# Altium schematic sheet P05_BCS1_Ethernet.SchDoc
size A3; Date: 24.11.2011; CheckedBy: Finke; Author: Mierau; DrawnBy: Mierau; SheetNumber: 5; SheetTotal: 8; Anlage: 78; Beschreibung: Qseven; Kunde: 56; ProjektName: BCS1; ProjektNummer: 88xxx; Ersatz_fuer: 12; ersetzt_durch: 34; LKNummer: 6190202; ID_Nummer: 90
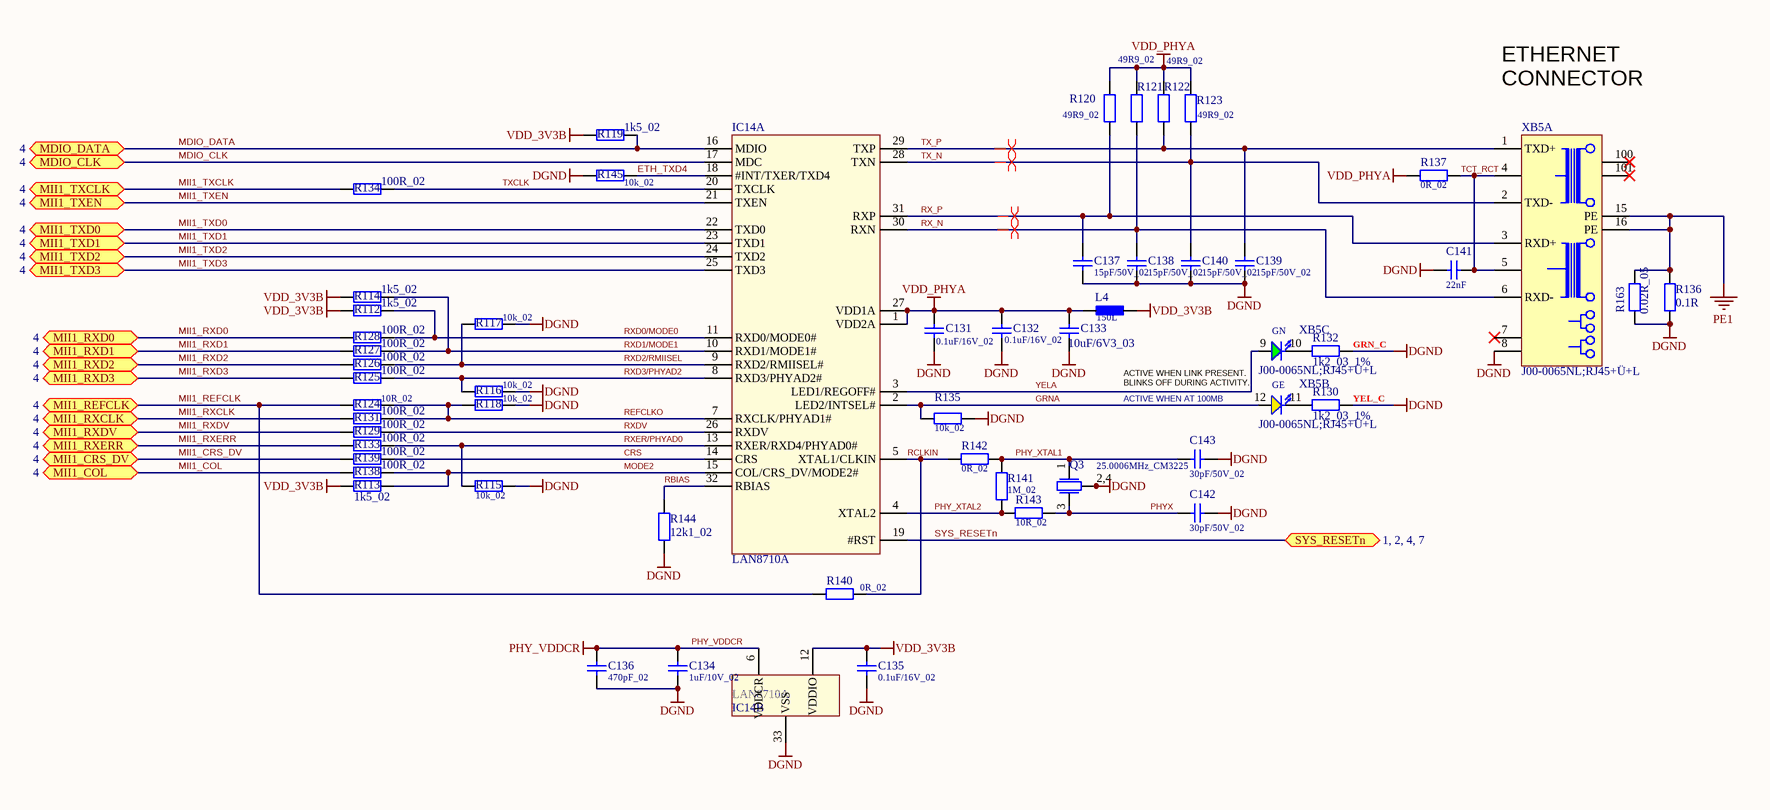
[diagram p0: P05_BCS1_Ethernet.SchDoc]

## Parts
C131  0.1uF/16V_02  [CC1005-0402]
C132  0.1uF/16V_02  [CC1005-0402]
C133  10uF/6V3_03  [CC1608-0603]
C134  1uF/10V_02  [CC1005-0402]
C135  0.1uF/16V_02  [CC1005-0402]
C136  470pF_02  [CC1005-0402]
C137  15pF/50V_02  [CC1005-0402]
C138  15pF/50V_02  [CC1005-0402]
C139  15pF/50V_02  [CC1005-0402]
C140  15pF/50V_02  [CC1005-0402]
C141  22nF  [CC2012-0805]
C142  30pF/50V_02  [CC1005-0402]
C143  30pF/50V_02  [CC1005-0402]
IC14  LAN8710A  [QFN32+EP]  (parts A,B of 2)
L4  150L  [CR2012-0805]
Q3  25.0006MHz_CM3225  [QUARZ CM3225]
R112  1k5_02  [CR1005-0402]
R113  1k5_02  [CR1005-0402]
R114  1k5_02  [CR1005-0402]
R115  10k_02  [CR1005-0402]
R116  10k_02  [CR1005-0402]
R117  10k_02  [CR1005-0402]
R118  10k_02  [CR1005-0402]
R119  1k5_02  [CR1005-0402]
R120  49R9_02  [CR1005-0402]
R121  49R9_02  [CR1005-0402]
R122  49R9_02  [CR1005-0402]
R123  49R9_02  [CR1005-0402]
R124  10R_02  [CR1005-0402]
R125  100R_02  [CR1005-0402]
R126  100R_02  [CR1005-0402]
R127  100R_02  [CR1005-0402]
R128  100R_02  [CR1005-0402]
R129  100R_02  [CR1005-0402]
R130  1k2_03_1%  [CR1608-0603]
R131  100R_02  [CR1005-0402]
R132  1k2_03_1%  [CR1608-0603]
R133  100R_02  [CR1005-0402]
R134  100R_02  [CR1005-0402]
R135  10k_02  [CR1005-0402]
R136  0.1R  [CR3216-1206]
R137  0R_02  [CR1005-0402]
R138  100R_02  [CR1005-0402]
R139  100R_02  [CR1005-0402]
R140  0R_02  [CR1005-0402]
R141  1M_02  [CR1005-0402]
R142  0R_02  [CR1005-0402]
R143  10R_02  [CR1005-0402]
R144  12k1_02  [CR1005-0402]
R145  10k_02  [CR1005-0402]
R163  0.02R_05  [CR2012-0805]
XB5  J00-0065NL;RJ45+Ü+L  [RJ45+Ü+L]  (parts A,B,C of 3)

## Ports
MDIO_CLK (see 4), MDIO_DATA (see 4), MII1_COL (see 4), MII1_CRS_DV (see 4), MII1_REFCLK (see 4), MII1_RXCLK (see 4), MII1_RXD0 (see 4), MII1_RXD1 (see 4), MII1_RXD2 (see 4), MII1_RXD3 (see 4), MII1_RXDV (see 4), MII1_RXERR (see 4), MII1_TXCLK (see 4), MII1_TXD0 (see 4), MII1_TXD1 (see 4), MII1_TXD2 (see 4), MII1_TXD3 (see 4), MII1_TXEN (see 4), SYS_RESETn (see 1, 2, 4, 7)

## Nets
DGND: C131.1 C132.1 C133.1 C134.1 C135.2 C136.1 C137.1 C138.1 C139.1 C140.1 C141.1 C142.2 C143.2 IC14.33(VSS) Q3.2(GND) Q3.4(GND) R115.2 R116.2 R117.2 R118.2 R130.2 R132.2 R135.2 R136.1 R144.2 R145.1 R163.1 XB5.8(NC)
PE1: R136.2 R163.2 XB5.15(PE) XB5.16(PE)
PHY_VDDCR: C134.2 C136.2 IC14.6(VDDCR)
VDD_3V3B: C135.1 IC14.12(VDDIO) L4.2 R112.2 R113.1 R114.2 R119.2
VDD_PHYA: C131.2 C132.2 C133.2 IC14.1(VDD2A) IC14.27(VDD1A) L4.1 R120.1 R121.1 R122.1 R123.1 R137.2
CRS: IC14.14(CRS) R139.2
ETH_TXD4: IC14.18(#INT/TXER/TXD4) R145.2
GRNA: IC14.2(LED2/INTSEL#) R135.1 XB5.12(A)
MDIO_CLK: IC14.17(MDC) ; port MDIO_CLK
MDIO_DATA: IC14.16(MDIO) R119.1 ; port MDIO_DATA
MII1_COL: R138.1 ; port MII1_COL
MII1_CRS_DV: R139.1 ; port MII1_CRS_DV
MII1_REFCLK: R124.1 R140.1 ; port MII1_REFCLK
MII1_RXCLK: R131.1 ; port MII1_RXCLK
MII1_RXD0: R128.1 ; port MII1_RXD0
MII1_RXD1: R127.1 ; port MII1_RXD1
MII1_RXD2: R126.1 ; port MII1_RXD2
MII1_RXD3: R125.1 ; port MII1_RXD3
MII1_RXDV: R129.1 ; port MII1_RXDV
MII1_RXERR: R133.1 ; port MII1_RXERR
MII1_TXCLK: R134.1 ; port MII1_TXCLK
MII1_TXD0: IC14.22(TXD0) ; port MII1_TXD0
MII1_TXD1: IC14.23(TXD1) ; port MII1_TXD1
MII1_TXD2: IC14.24(TXD2) ; port MII1_TXD2
MII1_TXD3: IC14.25(TXD3) ; port MII1_TXD3
MII1_TXEN: IC14.21(TXEN) ; port MII1_TXEN
MODE2: IC14.15(COL/CRS_DV/MODE2#) R113.2 R138.2
PHY_XTAL1: C143.1 Q3.1(X1) R141.1 R142.2
PHY_XTAL2: IC14.4(XTAL2) R141.2 R143.1
PHYX: C142.1 Q3.3(X2) R143.2
RBIAS: IC14.32(RBIAS) R144.1
RCLKIN: IC14.5(XTAL1/CLKIN) R140.2 R142.1
REFCLKO: IC14.7(RXCLK/PHYAD1#) R118.1 R124.2 R131.2
RX_N: C138.2 IC14.30(RXN) R121.2 XB5.6(RXD-)
RX_P: C137.2 IC14.31(RXP) R120.2 XB5.3(RXD+)
RXD0/MODE0: IC14.11(RXD0/MODE0#) R112.1 R128.2
RXD1/MODE1: IC14.10(RXD1/MODE1#) R114.1 R127.2
RXD2/RMIISEL: IC14.9(RXD2/RMIISEL#) R117.1 R126.2
RXD3/PHYAD2: IC14.8(RXD3/PHYAD2#) R116.1 R125.2
RXDV: IC14.26(RXDV) R129.2
RXER/PHYAD0: IC14.13(RXER/RXD4/PHYAD0#) R115.1 R133.2
SYS_RESETn: IC14.19(#RST) ; port SYS_RESETn
TCT_RCT: C141.2 R137.1 XB5.4(NC) XB5.5(NC)
TX_N: C140.2 IC14.28(TXN) R123.2 XB5.2(TXD-)
TX_P: C139.2 IC14.29(TXP) R122.2 XB5.1(TXD+)
TXCLK: IC14.20(TXCLK) R134.2
YELA: IC14.3(LED1/REGOFF#) XB5.9(A)
NetR130_1: R130.1 XB5.11(K)
NetR132_1: R132.1 XB5.10(K)

Not connected (* = marked no-connect by the designer): XB5 7(NC)* 100* 101*

## Layout directives
differential pair: RX_N, RX_P, TX_N, TX_P

## Notes on the sheet
- (near XB5) ETHERNET
  CONNECTOR
- (near R132) GRN_C
- ACTIVE WHEN LINK PRESENT.
  BLINKS OFF DURING ACTIVITY.
- ACTIVE WHEN AT 100MB
- (near R130) YEL_C
- Date
- Name
- REV.:
- editor:
- CAD:
- - SL (3)
- sheet:
- LK :
- checked:
- of:
- (in symbol Q25.0006MHz_CM3225) 2,4
- (in symbol XBRJ45-J00-0065_ML, part B) GE
- (in symbol XBRJ45-J00-0065_ML, part C) GN

## Library data of the parts
C131 C132 C135 = C0.1uF/16V_02: Capacitor 0402 16V Y5V; Value: 0.1uF/16V_02
C133 = C10uF/6V3_03: Capacitor 0603 6V3; 10%, X5R; Value: 10uF/6V3_03
C134 = C1uF/10V_02: Capacitor 0402 10V, X5R; Value: 1uF/10V_02
C136 = C470pF_02: Capacitor 0402; 50V X7R; Value: 470pF_02
C137-C140 = C15pF/50V_02: Capacitor 0402; 50V; Value: 15pF/50V_02
C141 = C22nF: Capacitor 0805; 50V; 10%; Value: 22nF
C142 C143 = C30pF/16V_02: Capacitor 0402 50V Y5V; Value: 30pF/50V_02
IC14 = ICLAN8710A: Small Footprint MII/RMII 10/100 Ethernet  Transceiver with HP Auto-MDIX and  flexPWR® Technology; Hersteller: SMSC-Microchip; Bestellbezeichnung: LAN8710A-EZK; Value: LAN8710A
L4 = L150 Ohm Ferrite: Inductor 120 Ohm Ferrite 0805, 800mA; Hersteller: Laird-Signal Integrity Products; Bestellbezeichnung: LI0805H151R-10; Value: 150L
Q3 = Q25.0006MHz_CM3225: Quarz 25.0006MHz; CM3225; Hersteller: Comtec Crystal; Bestellbezeichnung: CM3225- 25.0006MHz; Hersteller1: Geyer; Bestellbezeichnung1: CM3225- 25.0006MHz; Value: 25.0006MHz_CM3225
R112-R114 R119 = R1k5_02: Resistor 0402 1/16W 1%; Value: 1k5_02
R115-R118 R135 R145 = R10k_02: Resistor 0402; Value: 10k_02
R120-R123 = R49R9_02: Resistor 0402; Value: 49R9_02
R124 R143 = R10R_02: Resistor 0402; Value: 10R_02
R125-R129 R131 R133 R134 R138 R139 = R100R_02: Resistor 0402 1%; Value: 100R_02
R130 R132 = R1k2_03_1%: Resistor 0603; 1% 1/16W; Value: 1k2_03_1%
R136 = R0.1R: Resistor 1206; 1% 1/4W;; Value: 0.1R
R137 R140 R142 = R0R_02: Resistor 0402; Value: 0R_02
R141 = R1M_02: Resistor 0402; Value: 1M_02
R144 = R12k1_02: Resistor 0402; 1%; Value: 12k1_02
R163 = R0.02R_05: Resistor Bauform 0805; 5% 1/4W;; Value: 0.02R_05
XB5 = XBRJ45-J00-0065_ML: Buchse RJ45 mit Übertrager und LEDS; Hersteller: Pulse; Bestellbezeichnung1: 7499010211A; Hersteller1: Würth; Bestellbezeichnung: J00-0065NL; Value: J00-0065NL;RJ45+Ü+L